# EAGLE design IRQHack64 (EAGLE 6.6.0)
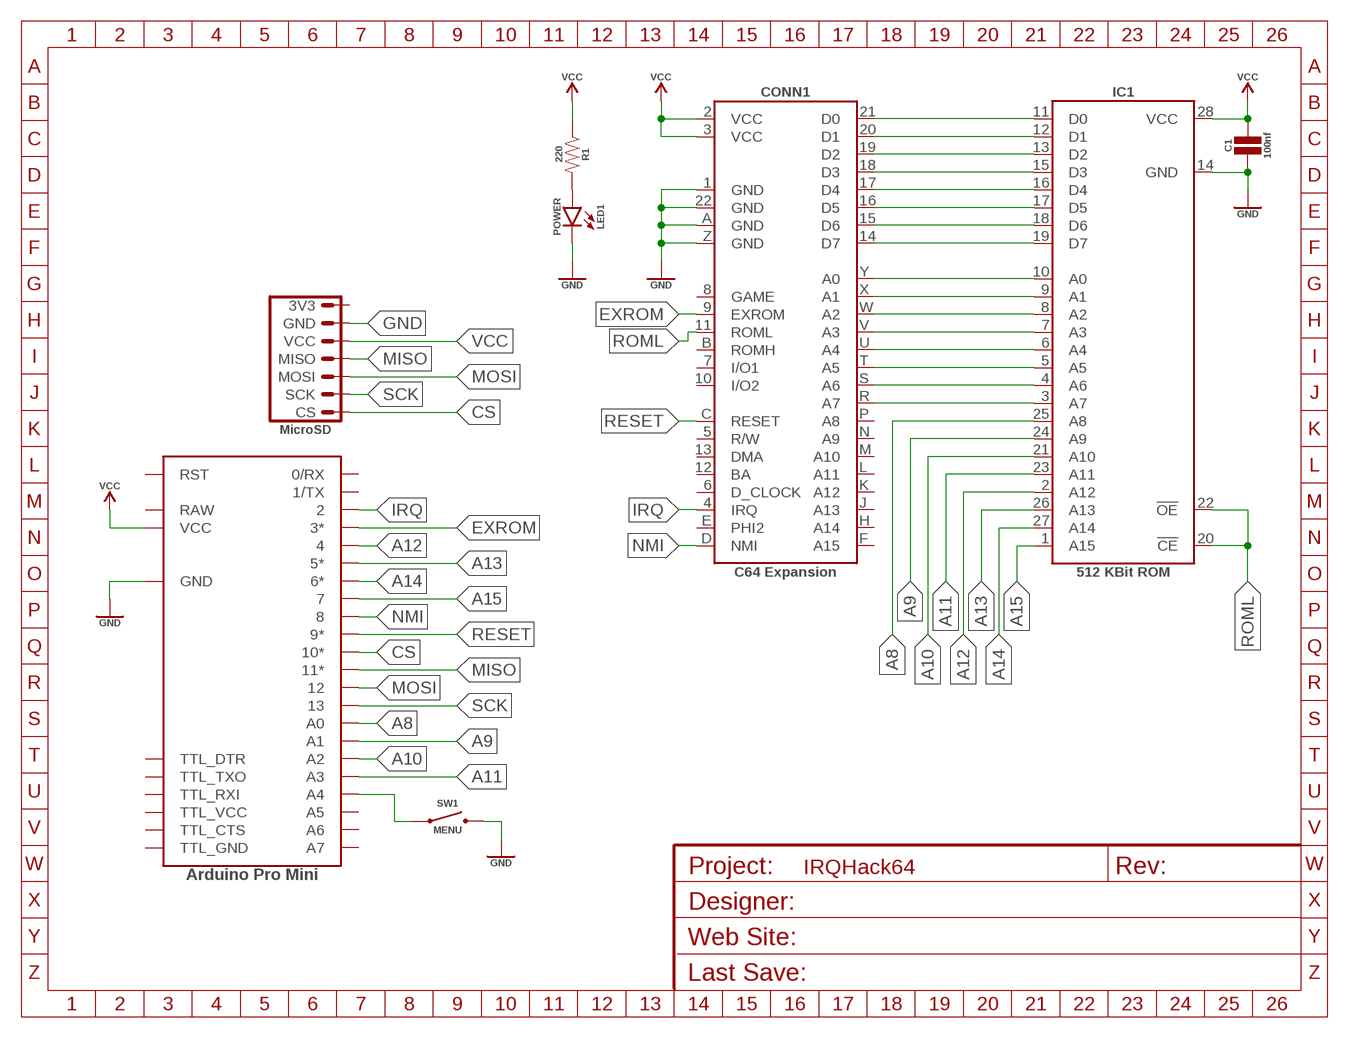
[diagram p0: schematic, sheet 1]
FRAME1 (FRAME_A5L): DESIGNER: i_r_on/CGTr & Simon/CGTr; REVISION: 1.0; WEBSITE: http://www.commodore.gen.tr

## Parts
C1  100nf  CAPACITOR_CERAMIC_0.2  [CAPACITOR_CERAMIC_0.2]
CONN1  C64 Expansion  C64_CARTDRIGE  [C64_CARTRIDGE]
IC1  512 KBit ROM  27C512_DIP  [DIP28W]
IC2  Arduino Pro Mini  PROMINI  [PROMINI]
LED1  POWER  LED_NORMAL_03MM  [LED_03MM]
R1  220  RESISTOR_THT_0.3  [RESISTOR_0.3]
SD1  MicroSD  MICROSD_RTL  [MICROSD_RTL]
SW1  MENU  SWITCH_THT_SIDEWITHPADS  [SWITCH_THT_SIDEWITHPADS]

## Nets
A0: CONN1.Y(A0) IC1.10(A0)
A1: CONN1.X(A1) IC1.9(A1)
A2: CONN1.W(A2) IC1.8(A2)
A3: CONN1.V(A3) IC1.7(A3)
A4: CONN1.U(A4) IC1.6(A4)
A5: CONN1.T(A5) IC1.5(A5)
A6: CONN1.S(A6) IC1.4(A6)
A7: CONN1.R(A7) IC1.3(A7)
A8: IC1.25(A8) IC2.A0
A9: IC1.24(A9) IC2.A1
A10: IC1.21(A10) IC2.A2
A11: IC1.23(A11) IC2.A3
A12: IC1.2(A12) IC2.4
A13: IC1.26(A13) IC2.5*
A14: IC1.27(A14) IC2.6*
A15: IC1.1(A15) IC2.7
CS: IC2.10* SD1.CS
D0: CONN1.21(D0) IC1.11(D0)
D1: CONN1.20(D1) IC1.12(D1)
D2: CONN1.19(D2) IC1.13(D2)
D3: CONN1.18(D3) IC1.15(D3)
D4: CONN1.17(D4) IC1.16(D4)
D5: CONN1.16(D5) IC1.17(D5)
D6: CONN1.15(D6) IC1.18(D6)
D7: CONN1.14(D7) IC1.19(D7)
EXROM: CONN1.9(EXROM) IC2.3*
GND: C1.1 CONN1.1(GND) CONN1.22(GND) CONN1.A(GND) CONN1.Z(GND) IC1.14(GND) IC2.GND@1(GND) IC2.GND@2(GND) LED1.CATHODE(C) SD1.GND SW1.2 SW1.BOTTOM
IRQ: CONN1.4(IRQ) IC2.2
LED0_1: LED1.ANODE(A) R1.2
MENU: IC2.A4@1(A4) IC2.A4@2(A4) SW1.1 SW1.TOP
MISO: IC2.11* SD1.MISO
MOSI: IC2.12 SD1.MOSI
NMI: CONN1.D(NMI) IC2.8
RESET: CONN1.C(RESET) IC2.9*
ROML: CONN1.11(ROML) IC1.20(!CE) IC1.22(!OE)
SCK: IC2.13 SD1.SCK
VCC: C1.2 CONN1.2(VCC) CONN1.3(VCC) IC1.28(VCC) IC2.VCC R1.1 SD1.VCC
Unconnected: CONN1.5(R/W) CONN1.6(D_CLOCK) CONN1.7(I/O1) CONN1.8(GAME) CONN1.10(I/O2) CONN1.12(BA) CONN1.13(DMA) CONN1.B(ROMH) CONN1.E(PHI2) CONN1.F(A15) CONN1.H(A14) CONN1.J(A13) CONN1.K(A12) CONN1.L(A11) CONN1.M(A10) CONN1.N(A9) CONN1.P(A8) IC2.0/RX IC2.1/TX IC2.A5@1(A5) IC2.A5@2(A5) IC2.A6@1(A6) IC2.A6@2(A6) IC2.A7@1(A7) IC2.A7@2(A7) IC2.RAW IC2.RST@1(RST) IC2.RST@2(RST) IC2.TTL_CTS IC2.TTL_DTR IC2.TTL_GND IC2.TTL_RXI IC2.TTL_TXO IC2.TTL_VCC SD1.3V3

## Library data of the parts
C1 = sj_standart:CAPACITOR_CERAMIC: Ceramic Capacitor
CONN1 = sj_commodore:C64_CARTDRIGE: C64 Cartridge Pads
IC1 = sj_ic:27C512: CMOS EPROM 512 K (64 K x 8)
IC2 = sj_arduino:PROMINI: Arduino Pro Mini
LED1 = sj_standart:LED_NORMAL: Standard LED
R1 = sj_standart:RESISTOR: Resistor
SD1 = sj_arduino:MICROSD: MicroSD Card Module
SW1 = sj_standart:SWITCH_THT: Switch (Through Hole Technology)

## Board
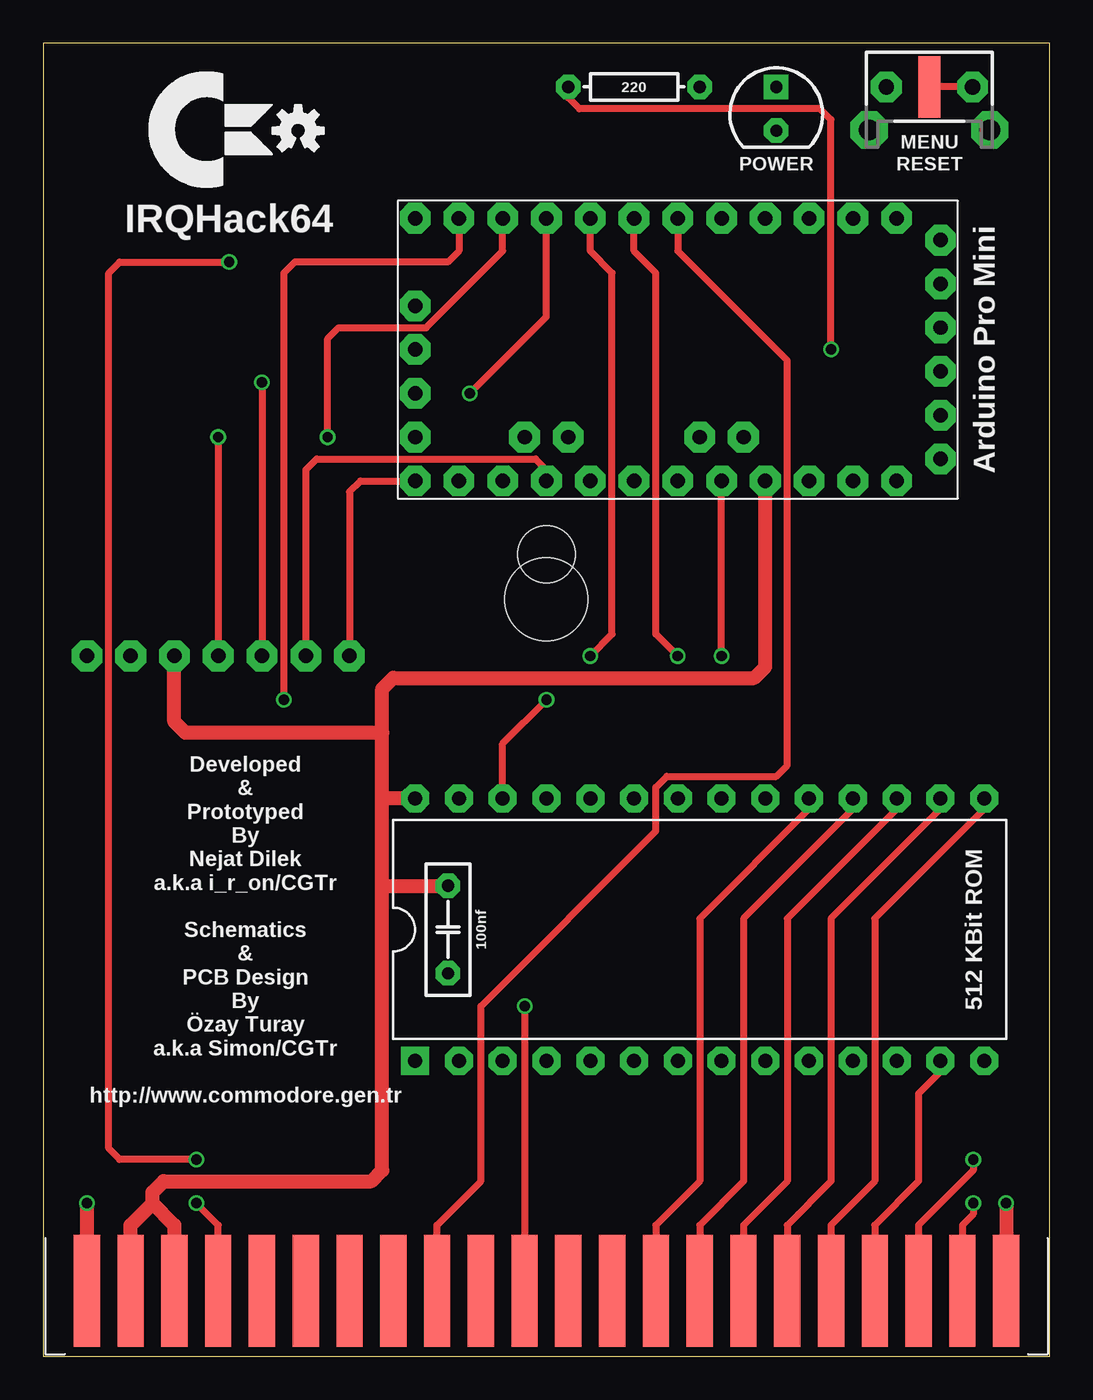
[diagram p1: board, top side]
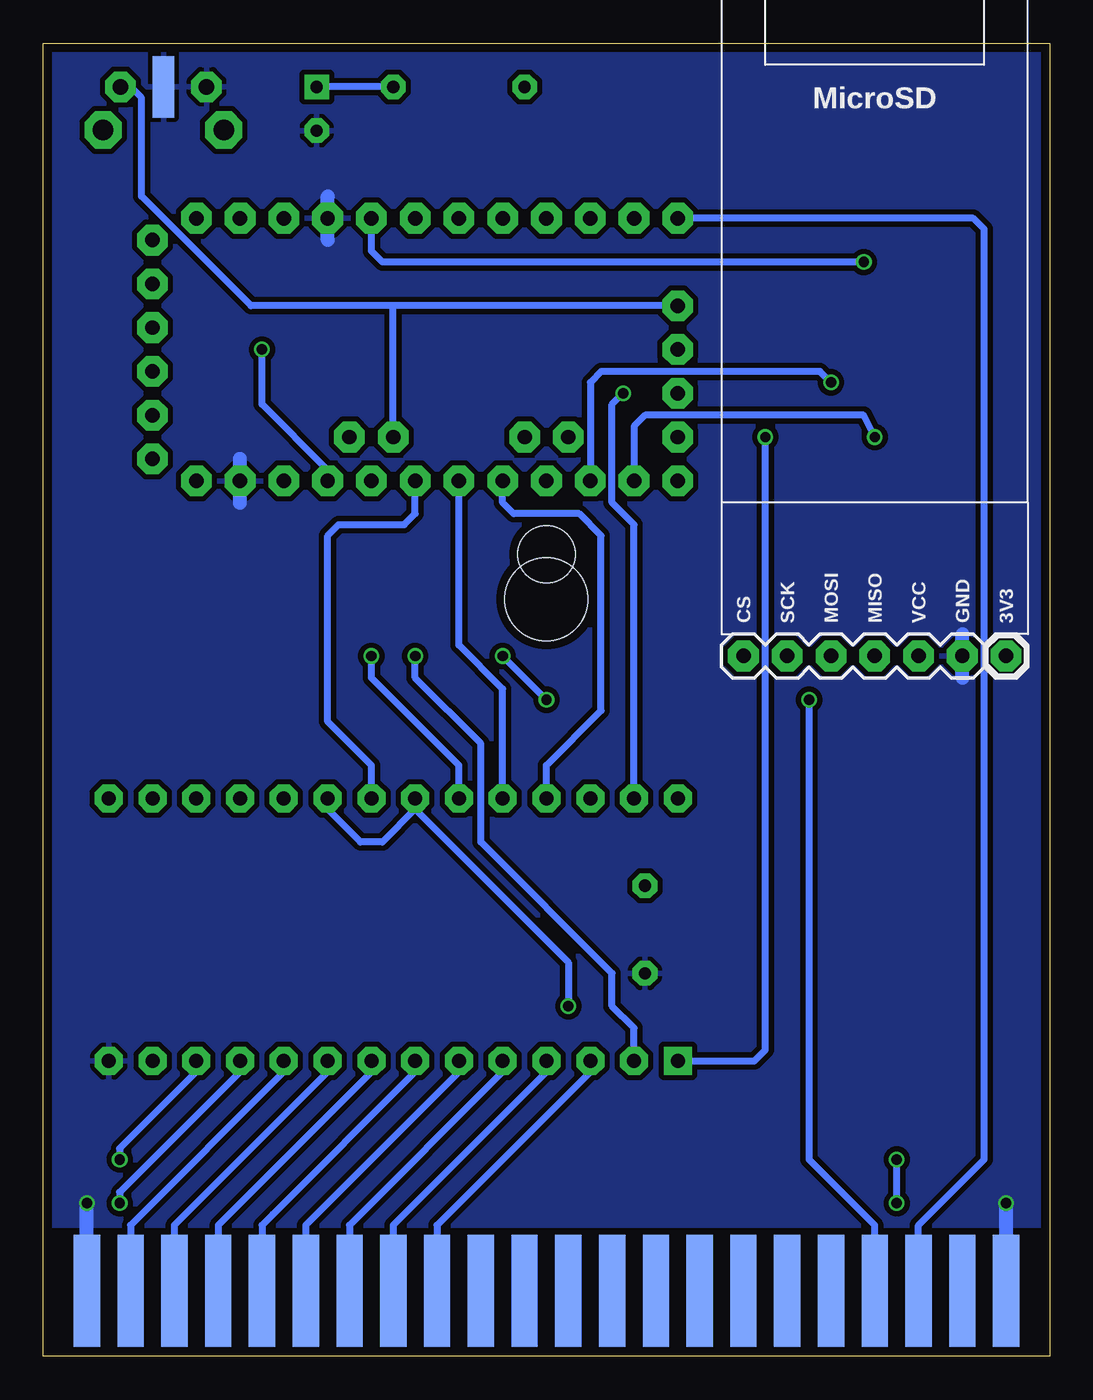
[diagram p2: board, bottom side, seen from below]

Size 58.42 x 76.2 mm. Coordinates in mm from the lower left corner, seen from the top.
Outline: 0,0 58.42,0 58.42,76.2 0,76.2 0,0
Copper layers (1*16): Top 0.035mm / dielectric 1.6mm / Bottom 0.035mm
Design rules "Elecrow": minimum track width 6mil, minimum drill 12mil, track to track 6mil, track to pad 6mil, pad to pad 6mil, via to via 8mil, smd to smd 0mil, copper to edge 20mil, drill to drill 10mil, minimum pad ring 6mil, minimum via ring 6mil, stop-mask expansion 0mil, vias tented up to drill 100mil, thermal gap 10mil
Holes 4.8 mm at 29.21,43.94
Holes 3.3 mm at 29.21,46.54

### Footprints (pad centres in the part's own frame; a part is rotated, then mirrored left to right if it is on the bottom)
CAPACITOR_CERAMIC_0.2 = drill 0.711 pad 1.422 octagon: 1 -2.54,0; 2 2.54,0
C64_CARTRIDGE = smd 1.524 x 6.477: 1 -26.67,-0.635; 2 -24.13,-0.635; 3 -21.59,-0.635; 4 -19.05,-0.635; 5 -16.51,-0.635; 6 -13.97,-0.635; 7 -11.43,-0.635; 8 -8.89,-0.635; 9 -6.35,-0.635; 10 -3.81,-0.635; 11 -1.27,-0.635; 12 1.27,-0.635; 13 3.81,-0.635; 14 6.35,-0.635; 15 8.89,-0.635; 16 11.43,-0.635; 17 13.97,-0.635; 18 16.51,-0.635; 19 19.05,-0.635; 20 21.59,-0.635; 21 24.13,-0.635; 22 26.67,-0.635 | smd 1.524 x 6.477 bottom: A -26.67,-0.635; B -24.13,-0.635; C -21.59,-0.635; D -19.05,-0.635; E -16.51,-0.635; F -13.97,-0.635; H -11.43,-0.635; J -8.89,-0.635; K -6.35,-0.635; L -3.81,-0.635; M -1.27,-0.635; N 1.27,-0.635; P 3.81,-0.635; R 6.35,-0.635; S 8.89,-0.635; T 11.43,-0.635; U 13.97,-0.635; V 16.51,-0.635; W 19.05,-0.635; X 21.59,-0.635; Y 24.13,-0.635; Z 26.67,-0.635
DIP28W = drill 0.813 pad 1.626 square: 1 -16.51,-7.62 | drill 0.813 pad 1.626 octagon: 2 -13.97,-7.62; 3 -11.43,-7.62; 4 -8.89,-7.62; 5 -6.35,-7.62; 6 -3.81,-7.62; 7 -1.27,-7.62; 8 1.27,-7.62; 9 3.81,-7.62; 10 6.35,-7.62; 11 8.89,-7.62; 12 11.43,-7.62; 13 13.97,-7.62; 14 16.51,-7.62; 15 16.51,7.62; 16 13.97,7.62; 17 11.43,7.62; 18 8.89,7.62; 19 6.35,7.62; 20 3.81,7.62; 21 1.27,7.62; 22 -1.27,7.62; 23 -3.81,7.62; 24 -6.35,7.62; 25 -8.89,7.62; 26 -11.43,7.62; 27 -13.97,7.62; 28 -16.51,7.62
PROMINI = drill 0.838 pad 1.778 octagon: 0/RX 10.16,7.62; 1/TX 12.7,7.62; 2 2.54,7.62; 3* 0,7.62; 4 -2.54,7.62; 5* -5.08,7.62; 6* -7.62,7.62; 7 -10.16,7.62; 8 -12.7,7.62; 9* -15.24,7.62; 10* -15.24,-7.62; 11* -12.7,-7.62; 12 -10.16,-7.62; 13 -7.62,-7.62; A0 -5.08,-7.62; A1 -2.54,-7.62; A2 0,-7.62; A3 2.54,-7.62; A4@1 1.27,-5.08; A4@2 -15.24,2.54; A5@1 3.81,-5.08; A5@2 -15.24,0; A6@1 -15.24,-2.54; A6@2 -8.89,-5.08; A7@1 -15.24,-5.08; A7@2 -6.35,-5.08; GND@1 10.16,-7.62; GND@2 5.08,7.62; RAW 12.7,-7.62; RST@1 7.62,-7.62; RST@2 7.62,7.62; TTL_CTS 15.24,-3.81; TTL_DTR 15.24,6.35; TTL_GND 15.24,-6.35; TTL_RXI 15.24,1.27; TTL_TXO 15.24,3.81; TTL_VCC 15.24,-1.27; VCC 5.08,-7.62
LED_03MM = drill 0.711 pad 1.422 square: ANODE -1.27,0 | drill 0.711 pad 1.422 octagon: CATHODE 1.27,0
RESISTOR_0.3 = drill 0.711 pad 1.422 octagon: 1 -3.81,0; 2 3.81,0
MICROSD_RTL = drill 0.838 pad 1.778 octagon: 3V3 7.62,1.27; CS -7.62,1.27; GND 5.08,1.27; MISO 0,1.27; MOSI -2.54,1.27; SCK -5.08,1.27; VCC 2.54,1.27
SWITCH_THT_SIDEWITHPADS = drill 0.889 pad 1.778 octagon: 1 -2.5,0; 2 2.5,0 | drill 1.194 pad 2.159 octagon: ANCHOR1 -3.5,2.5; ANCHOR2 3.5,2.5 | smd 1.27 x 3.556 bottom: BOTTOM 0,0 | smd 1.27 x 3.556: TOP 0,0

### Placement (x,y rotation side)
C1  23.5,24.77 90 top
CONN1  29.21,4.45 0 top
IC1  38.1,24.77 0 top
IC2  36.83,58.42 0 top
LED1  42.55,72.39 270 top
LOGO1  OSHW_LOGO_SMALL  [OSHW_LOGO_SMALL]  14.8,71.12 0 top
R1  34.29,73.66 0 top
SD1  10.16,39.37 0 bottom
SW1  51.44,73.66 180 top

### Tracks (layer width: path | path; a pad name or v marks a point on that pad's centre or on a via)
A0
  Bottom 0.406: IC1.10 44.45,16.51 53.34,7.62 CONN1.Y
A1
  Bottom 0.406: IC1.9 41.91,16.51 50.8,7.62 50.8,6.99 CONN1.X
A2
  Bottom 0.406: IC1.8 39.37,16.51 48.26,7.62 48.26,6.99 CONN1.W
A3
  Bottom 0.406: IC1.7 36.83,16.51 45.09,8.26 45.72,7.62 45.72,6.99 CONN1.V
A4
  Bottom 0.406: IC1.6 34.29,16.51 43.18,7.62 43.18,6.99 CONN1.U
A5
  Bottom 0.406: IC1.5 31.75,16.51 40.64,7.62 40.64,6.99 CONN1.T
A6
  Bottom 0.406: IC1.4 29.21,16.51 38.1,7.62 38.1,6.99 CONN1.S
A7
  Bottom 0.406: IC1.3 26.67,16.51 35.56,7.62 CONN1.R
A8
  Bottom 0.406: IC1.25 29.21,34.29 26.04,37.47 26.04,47.62 27.3,48.9 31.11,48.9 31.75,49.53 IC2.A0
A9
  Bottom 0.406: IC1.24 31.75,38.73 34.29,41.27 IC2.A1
A10
  Bottom 0.406: IC1.21 39.37,34.29 41.91,36.83 41.91,47.62 41.27,48.26 37.47,48.26 36.83,48.9 IC2.A2
A11  (via drill 0.6)
  Top 0.406: v39.37,40.64 IC2.A3
  Bottom 0.406: IC1.23 34.29,34.29 39.37,39.37 v39.37,40.64
A12  (via drill 0.6)
  Top 0.406: v36.83,40.64 35.56,41.91 35.56,62.87 34.29,64.14 IC2.4
  Bottom 0.406: IC1.2 24.13,19.05 25.4,20.32 25.4,22.23 33.02,29.84 33.02,35.56 36.83,39.37 v36.83,40.64
A13  (via drill 0.6)
  Top 0.406: IC1.26 26.67,35.56 v29.21,38.1 | v31.75,40.64 33.02,41.91 33.02,62.87 31.75,64.14 IC2.5*
  Bottom 0.406: v29.21,38.1 v31.75,40.64
A14  (via drill 0.6)
  Top 0.406: v24.77,55.88 29.21,60.33 IC2.6*
  Bottom 0.406: IC1.27 24.13,48.26 25.4,49.53 25.4,55.24 v24.77,55.88
A15  (via drill 0.6)
  Top 0.406: v16.51,53.34 16.51,59.05 17.14,59.69 22.23,59.69 26.67,64.14 IC2.7
  Bottom 0.406: IC1.1 17.14,17.14 16.51,17.78 v16.51,53.34
CS
  Top 0.406: IC2.10* 18.41,50.8 17.78,50.16 SD1.CS
D0  (via drill 0.6)
  Top 0.406: v53.98,8.89 53.98,8.26 53.34,7.62 CONN1.21
  Bottom 0.406: IC1.11 46.99,16.51 53.98,9.53 v53.98,8.89
D1  (via drill 0.6)
  Top 0.406: v53.98,11.43 53.98,10.79 50.8,7.62 CONN1.20
  Bottom 0.406: IC1.12 49.53,16.51 53.98,12.06 v53.98,11.43
D2
  Top 0.406: IC1.13 52.07,16.51 50.8,15.24 50.8,10.16 48.26,7.62 CONN1.19
D3
  Top 0.406: IC1.15 54.61,31.75 48.26,25.4 48.26,10.16 45.72,7.62 CONN1.18
D4
  Top 0.406: IC1.16 52.07,31.75 45.72,25.4 45.72,10.16 43.18,7.62 CONN1.17
D5
  Top 0.406: IC1.17 49.53,31.75 43.18,25.4 43.18,10.16 40.64,7.62 CONN1.16
D6
  Top 0.406: IC1.18 46.99,31.75 40.64,25.4 40.64,10.16 38.1,7.62 CONN1.15
D7
  Top 0.406: IC1.19 44.45,31.75 38.1,25.4 38.1,10.16 35.56,7.62 CONN1.14
EXROM
  Top 0.406: CONN1.9 22.86,7.62 25.4,10.16 25.4,20.32 35.56,30.48 35.56,33.02 36.2,33.66 42.55,33.66 43.18,34.29 43.18,57.78 36.83,64.14 IC2.3*
GND  (via drill 0.6)
  Top 0.813: v2.54,8.89 CONN1.A | v55.88,8.89 CONN1.Z
  Bottom 0.813: CONN1.A v2.54,8.89 | CONN1.Z v55.88,8.89 | 5.08,39.37 5.08,41.91 | 41.91,64.77 41.91,67.31 | 46.99,49.53 46.99,52.07
  pour Bottom (isolate 0.305): 0,7.62 58.42,7.62 58.42,85.09 0,85.09
IRQ  (via drill 0.6)
  Top 0.406: CONN1.4 10.16,7.62 v8.89,8.89 | v8.89,11.43 4.45,11.43 3.81,12.06 3.81,62.87 4.45,63.5 v10.79,63.5
  Bottom 0.406: v8.89,8.89 v8.89,11.43 | v10.79,63.5 38.73,63.5 39.37,64.14 IC2.2
LED0_1
  Bottom 0.406: R1.2 LED1.ANODE
MENU
  Top 0.406: SW1.1 SW1.TOP
  Bottom 0.406: SW1.1 53.34,73.66 52.7,73.03 52.7,67.31 46.35,60.96 38.1,60.96 | IC2.A4@2 38.1,60.96 | IC2.A4@1 38.1,60.96
MISO  (via drill 0.6)
  Top 0.406: v10.16,53.34 SD1.MISO
  Bottom 0.406: v10.16,53.34 10.79,54.61 23.5,54.61 24.13,53.98 IC2.11*
MOSI  (via drill 0.6)
  Top 0.406: v12.7,56.52 SD1.MOSI
  Bottom 0.406: v12.7,56.52 13.34,57.15 26.04,57.15 26.67,56.52 IC2.12
NMI  (via drill 0.6)
  Top 0.406: IC2.8 24.13,64.14 23.5,63.5 14.61,63.5 13.97,62.87 v13.97,38.1
  Bottom 0.406: v13.97,38.1 13.97,11.43 10.16,7.62 CONN1.D
RESET
  Bottom 0.406: CONN1.C 7.62,7.62 3.81,11.43 3.81,65.41 4.45,66.04 IC2.9*
ROML  (via drill 0.6)
  Top 0.406: v27.94,20.32 CONN1.11
  Bottom 0.406: 36.83,31.75 38.73,29.84 40.01,29.84 41.91,31.75 IC1.20 | 36.83,31.75 27.94,22.86 v27.94,20.32 | IC1.22 36.83,31.75
SCK
  Top 0.406: IC2.13 29.21,51.44 28.57,52.07 15.88,52.07 15.24,51.44 SD1.SCK
VCC  (via drill 0.6)
  Top 0.406: v45.72,58.42 45.72,71.75 45.09,72.39 31.11,72.39 30.48,73.03 R1.1
  Top 0.813: CONN1.3 7.62,7.62 6.35,8.89 | CONN1.2 5.08,7.62 6.35,8.89 | 19.68,27.3 19.68,10.79 19.05,10.16 6.99,10.16 6.35,9.53 6.35,8.89 | 19.68,27.3 C1.2 | 19.68,27.3 19.68,32.38 | 19.68,32.38 19.68,36.2 | 19.68,36.2 19.68,38.73 20.32,39.37 41.27,39.37 41.91,40.01 IC2.VCC | IC1.28 19.68,32.38 | SD1.VCC 7.62,36.83 8.26,36.2 19.68,36.2
  Bottom 0.406: IC2.VCC 41.91,51.44 45.72,55.24 v45.72,58.42

### Text on the board
tPlace: RESET | IRQHack64 | Developed / & / Prototyped / By / Nejat Dilek / a.k.a i_r_on/CGTr / / Schematics / & / PCB Design / By / Özay Turay / a.k.a Simon/CGTr / / http://www.commodore.gen.tr